# Altium schematic sheet Sheet_FT4232_USB.SchDoc
size 330 x 203 mm
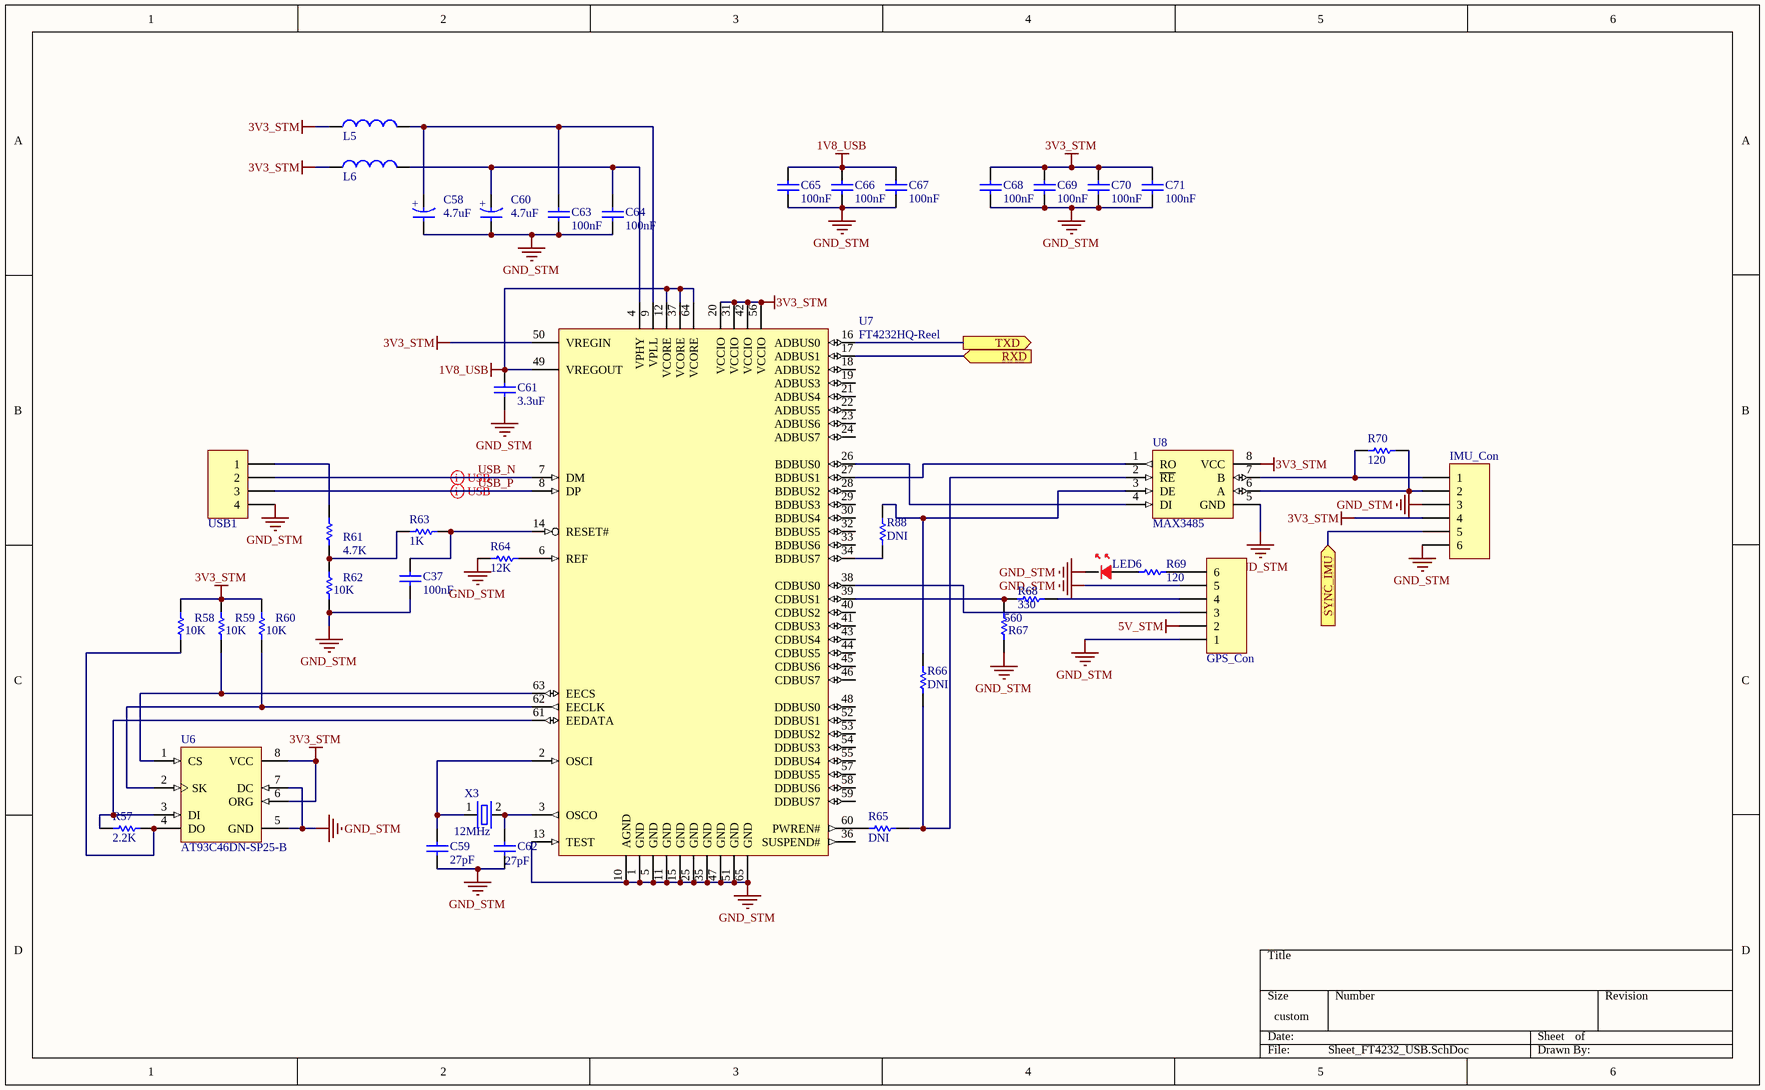
[diagram p0: Sheet_FT4232_USB.SchDoc]

## Parts
C37  100nF  [1608[0603]]
C58  4.7uF  [6032 [2312]]
C59  27pF  [1608[0603]]
C60  4.7uF  [6032 [2312]]
C61  3.3uF  [1608[0603]]
C62  27pF  [1608[0603]]
C63  100nF  [1608[0603]]
C64  100nF  [1608[0603]]
C65  100nF  [1608[0603]]
C66  100nF  [1608[0603]]
C67  100nF  [1608[0603]]
C68  100nF  [1608[0603]]
C69  100nF  [1608[0603]]
C70  100nF  [1608[0603]]
C71  100nF  [1608[0603]]
H19  USB1  [Header 4  -MolexPicoBlade]
H20  GPS_Con  [Header 6  ZH-SM4]
H21  IMU_Con  [Header 6  -MolexPicoBlade]
L5  ?H  [0805]  (value not drawn)
L6  ?H  [0805]  (value not drawn)
LED6  LEDR  [2012[0805]]  (value not drawn)
R57  2.2K  [1608[0603]]
R58  10K  [1608[0603]]
R59  10K  [1608[0603]]
R60  10K  [1608[0603]]
R61  4.7K  [1608[0603]]
R62  10K  [1608[0603]]
R63  1K  [1608[0603]]
R64  12K  [1608[0603]]
R65  DNI  [1608[0603]]
R66  DNI  [1608[0603]]
R67  560  [1608[0603]]
R68  330  [1608[0603]]
R69  120  [1608[0603]]
R70  120  [1608[0603]]
R88  DNI  [1608[0603]]
U6  AT93C46DN-SP25-B  [8S1_M]
U7  FT4232HQ-Reel  [QFN64_2_L_Smaller_Holes]
U8  MAX3485  [SOIC8]
X3  12MHz  [ABM7]

## Ports
RXD (in), SYNC_IMU (in), TXD (out)

## Nets
1V8_USB: C61.1 C65.1 C66.1 C67.1 U7.12(VCORE) U7.37(VCORE) U7.49(VREGOUT) U7.64(VCORE)
3V3_STM: C68.1 C69.1 C70.1 C71.1 H21.4 L5.1 L6.1 R58.2 R59.2 R60.2 U6.6(ORG) U6.8(VCC) U7.20(VCCIO) U7.31(VCCIO) U7.42(VCCIO) U7.50(VREGIN) U7.56(VCCIO) U8.8(VCC)
5V_STM: H20.2
GND_STM: C37.2 C58.1 C59.2 C60.1 C61.2 C62.2 C63.2 C64.2 C65.2 C66.2 C67.2 C68.2 C69.2 C70.2 C71.2 H19.4 H20.1 H20.5 H21.3 H21.6 LED6.2(K) R62.1 R64.2 R67.1 U6.5(GND) U6.7(DC) U7.1(GND) U7.5(GND) U7.10(AGND) U7.11(GND) U7.13(TEST) U7.15(GND) U7.25(GND) U7.35(GND) U7.47(GND) U7.51(GND) U7.65(GND) U8.5(GND)
RXD: U7.17(ADBUS1) ; port RXD
SYNC_IMU: H21.5 ; port SYNC_IMU
TXD: U7.16(ADBUS0) ; port TXD
USB_N: H19.2 U7.7(DM)
USB_P: H19.3 U7.8(DP)
NetC37_1: C37.1 R63.1 U7.14(RESET#)
NetC58_2: C58.2 C63.1 L5.2 U7.9(VPLL)
NetC59_1: C59.1 U7.2(OSCI) X3.1(OSC1)
NetC60_2: C60.2 C64.1 L6.2 U7.4(VPHY)
NetC62_1: C62.1 U7.3(OSCO) X3.2(OSC2)
NetH19_1: H19.1 R61.2
NetH20_3: H20.3 U7.38(CDBUS0)
NetH20_4: H20.4 R68.2
NetH20_6: H20.6 R69.1
NetH21_1: H21.1 R70.2 U8.7(B)
NetH21_2: H21.2 R70.1 U8.6(A)
NetLED6_1: LED6.1(A) R69.2
NetR57_1: R57.1 R58.1 U6.4(DO)
NetR57_2: R57.2 U6.3(DI) U7.61(EEDATA)
NetR59_1: R59.1 U6.1(CS) U7.63(EECS)
NetR60_1: R60.1 U6.2(SK) U7.62(EECLK)
NetR61_1: R61.1 R62.2 R63.2
NetR64_1: R64.1 U7.6(REF)
NetR65_1: R65.1 U7.60(PWREN#)
NetR65_2: R65.2 R66.2 U8.2(~{RE})
NetR66_1: R66.1 R88.2 U8.3(DE)
NetR67_2: R67.2 R68.1 U7.39(CDBUS1)
NetR88_1: R88.1 U7.34(BDBUS7)
NetU7_26: U7.26(BDBUS0) U8.4(DI)
NetU7_27: U7.27(BDBUS1) U8.1(RO)

Not connected (* = marked no-connect by the designer): U7 18(ADBUS2) 19(ADBUS3) 21(ADBUS4) 22(ADBUS5) 23(ADBUS6) 24(ADBUS7) 28(BDBUS2) 29(BDBUS3) 30(BDBUS4) 32(BDBUS5) 33(BDBUS6) 36(SUSPEND#) 40(CDBUS2) 41(CDBUS3) 43(CDBUS4) 44(CDBUS5) 45(CDBUS6) 46(CDBUS7) 48(DDBUS0) 52(DDBUS1) 53(DDBUS2) 54(DDBUS3) 55(DDBUS4) 57(DDBUS5) 58(DDBUS6) 59(DDBUS7)

## Layout directives
differential pair: USB_N, USB_P

## Notes on the sheet
- (in symbol Cap_E) +

## Library data of the parts
C37 C59 C61-C71 = Cap_BP: Capacitor; Supplier 1: Digi-Key
  C37 C63-C71: Value: 100nF; Supplier Part Number 1: 311-1088-1-ND
  C59 C62: Value: 27pF; Supplier Part Number 1: 399-7888-1-ND
  C61: Value: 3.3uF; Supplier Part Number 1: 445-5168-1-ND
C58 C60 = Cap_E: Capacitor; Value: 4.7uF; Supplier 1: Digi-Key; Supplier Part Number 1: 478-1717-1-ND
H19 = Header 4: Supplier 1: Digi-Key; Supplier Part Number 1: WM7608CT-ND
H20 H21 = Header 6: Supplier 1: Digi-Key
  H20: Supplier Part Number 1: 455-1685-1-ND
  H21: Supplier Part Number 1: WM7610CT-ND
L5 L6 = Inductor: Value: ?H; Supplier 1: Digi-Key; Supplier Part Number 1: 587-1764-1-ND
LED6 = LED_R: LED; Value: ?; Supplier 1: Digi-Key; Supplier Part Number 1: 475-1278-1-ND
R57-R70 R88 = Res
  R57: Value: 2.2K; Supplier 1: Digi-Key; Supplier Part Number 1: RMCF0603JT2K20CT-ND
  R58-R60 R62: Value: 10K; Supplier 1: Digi-Key; Supplier Part Number 1: P10KGCT-ND
  R61: Value: 4.7K; Supplier 1: Digi-Key; Supplier Part Number 1: P4.7KGCT-ND
  R63: Value: 1K; Supplier 1: Digi-Key; Supplier Part Number 1: P1.0KGCT-ND
  R64: Value: 12K; Supplier 1: Digi-Key; Supplier Part Number 1: 311-12KGRCT-ND
  R65 R66 R88: Value: DNI
  R67: Value: 560; Supplier 1: Digi-Key; Supplier Part Number 1: 311-560HRCT-ND
  R68: Value: 330; Supplier 1: Digi-Key; Supplier Part Number 1: 311-330GRCT-ND
  R69 R70: Value: 120; Supplier 1: Digi-Key; Supplier Part Number 1: RMCF0603JT120RCT-ND
U6 = AT93C46DN-SP25-B: 1Kbit (128 x 8 or 64 x 16), 3-wire Bus Serial Automotive EEPROM, 2.5V, 8-Pin SOIC, Bulk; Published: 20-Sep-2010; DatasheetVersion: 8674B,  Oct-2009; PackageVersion: revC, Mar-2005; PackageReference: 8S1; Publisher: Altium Limited; PackageDescription: 8-Lead (0.150" Wide Body), Plastic Gull Wing Small Outline (JEDEC SOIC); Code_JEDEC: MS-012-AA; Code_IPC: SOIC127P600-8; ComponentLink1Description: Manufacturer Link; ComponentLink1URL: http://www.atmel.com/products/serial/default.asp; ComponentLink2Description: Datasheet; ComponentLink2URL: http://www.atmel.com/dyn/resources/prod_documents/doc8674.pdf; ComponentLink3Description: Atmel.com Home; ComponentLink3URL: http://www.atmel.com; Supplier 1: Digi-Key; Supplier Part Number 1: AT93C46DN-SH-B-ND
U7 = FT4232HQ-Reel: Quad High Speed USB To Multipurpose UART/MPSSE IC, QFN-64, Tape and Reel; Published: 30-Aug-2010; DatasheetVersion: ver 2.08, May-2010; PackageVersion: 2010; PackageReference: QFN64_2; Publisher: Altium Limited; PackageDescription: 64-Pin Quad Flat No-Lead, 9 x 9 mm Body, 0.5 mm Pitch, 4.35 x 4.35 mm Exposed Pad; ComponentLink1Description: Manufacturer Link; ComponentLink1URL: http://www.ftdichip.com/Products/ICs/FT4232H.htm; ComponentLink2Description: Datasheet; ComponentLink2URL: http://www.ftdichip.com/Support/Documents/DataSheets/ICs/DS_FT4232H.pdf; Supplier 1: Digi-Key; Supplier Part Number 1: 768-1027-1-ND
X3 = XTAL: Crystal Oscillator; Published: 8-Jun-2000; LatestRevisionDate: 17-Jul-2002; LatestRevisionNote: Re-released for DXP Platform.; PackageReference: R38; Publisher: Altium Limited; Value: 12MHz; Supplier 1: Digi-Key; Supplier Part Number 1: 535-13457-1-ND
U8 = MAX3485: Supplier 1: Digi-Key; Supplier Part Number 1: MAX3485CSA+-ND